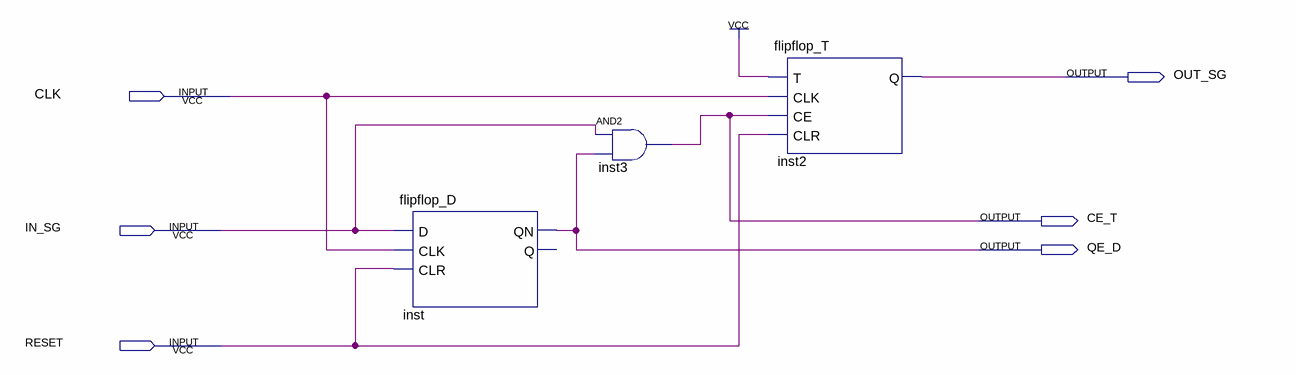
[diagram p0: schematic sheet]
// Quartus schematic Stop_go.bdf as structural Verilog: 3 symbols, 6 pins
module Stop_go (
  input  CLK,
  input  IN_SG,
  input  RESET,
  output OUT_SG,
  output CE_T,
  output QE_D
);

  flipflop_D inst (.D(IN_SG), .CLK(CLK), .CLR(RESET), .QN(QE_D));  // open: Q
  and inst3 (CE_T, IN_SG, QE_D);
  flipflop_T inst2 (.T(1'b1), .CLK(CLK), .CE(CE_T), .CLR(RESET), .Q(OUT_SG));
endmodule
